# Altium schematic sheet ESP_INPUT_MUX.SchDoc
size A4; SheetNumber: 14; SheetTotal: 16
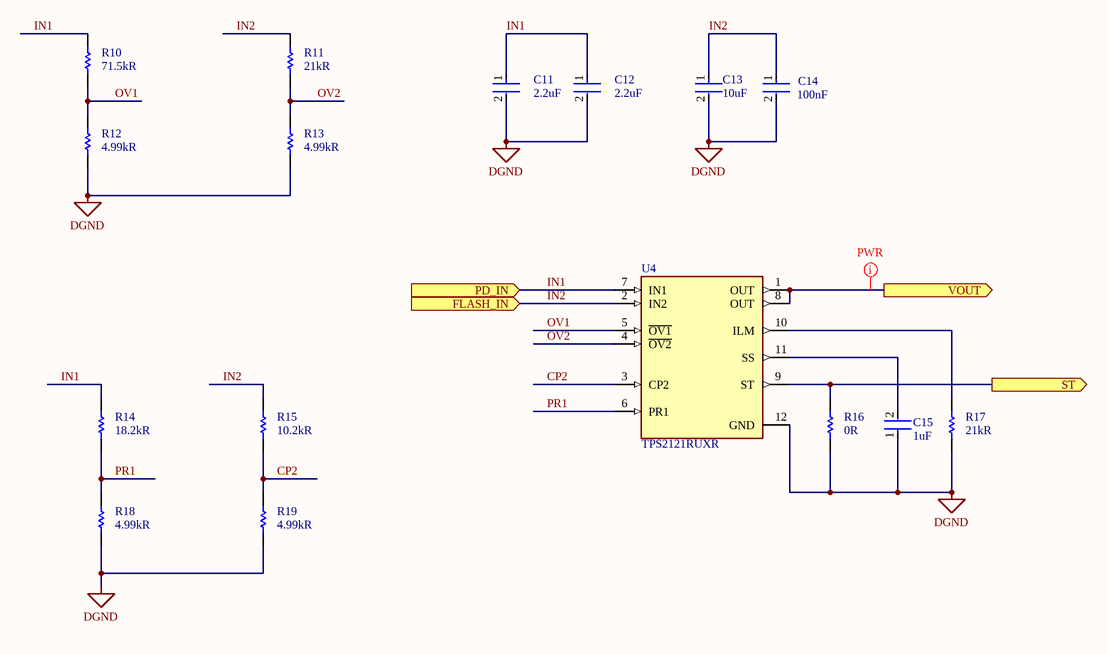
[diagram p0: ESP_INPUT_MUX.SchDoc]

## Parts
C11  Capacitance: 2.2uF  [FP-GRM188-0_2-IPC_C]  (hidden comment: GRM188R61H225KE11D)
C12  Capacitance: 2.2uF  [FP-GRM188-0_2-IPC_C]  (hidden comment: GRM188R61H225KE11D)
C13  value 10uF  [FP-GRM155-0_2-IPC_A]  (hidden comment: GRM155R61A106ME11D)
C14  value 100nF  [FP-CC0402-IPC_B]  (hidden comment: CC0402KRX7R9BB104)
C15  value 1uF  [FP-0402-L_1_0_0_05-W_0_5-MFG]  (hidden comment: EMK105BJ105KV-F)
R10  value 71.5kR  [RESC1005X40X25LL10T10]  (hidden comment: RK73H1ETTP7152F)
R11  value 21kR  [RESC1005X40X25LL10T10]  (hidden comment: RK73H1ETTP2102F)
R12  value 4.99kR  [RESC1005X40X25LL10T10]  (hidden comment: RK73H1ETTP4991F)
R13  value 4.99kR  [RESC1005X40X25LL10T10]  (hidden comment: RK73H1ETTP4991F)
R14  value 18.2kR  [RESC1005X40X25LL10T10]  (hidden comment: RK73H1ETTP1822F)
R15  value 10.2kR  [RESC1005X40X25LL10T10]  (hidden comment: RK73H1ETTP1022F)
R16  value 0R  [FP-RK73Z1E-IPC_B]  (hidden comment: RK73Z1ETTP)  (no BOM)
R17  value 21kR  [RESC1005X40X25ML10T10]  (hidden comment: RK73H1ETTP2102F)
R18  value 4.99kR  [RESC1005X40X25LL10T10]  (hidden comment: RK73H1ETTP4991F)
R19  value 4.99kR  [RESC1005X40X25LL10T10]  (hidden comment: RK73H1ETTP4991F)
U4  TPS2121RUXR  [FP-RUX0012A-MFG]

## Ports
FLASH_IN (in), PD_IN (in), ST (out), VOUT (out)

## Nets
DGND: C11.2 C12.2 C13.2 C14.2 C15.1 R12.1 R13.1 R16.1 R17.1 R18.1 R19.1 U4.12(GND)
CP2: R15.1 R19.2 U4.3(CP2)
IN1: C11.1 C12.1 R10.2 R14.2 U4.7(IN1) ; port PD_IN
IN2: C13.1 C14.1 R11.2 R15.2 U4.2(IN2) ; port FLASH_IN
OV1: R10.1 R12.2 U4.5(~{OV1})
OV2: R11.1 R13.2 U4.4(~{OV2})
PR1: R14.1 R18.2 U4.6(PR1)
ST: R16.2 U4.9(ST) ; port ST
VOUT: U4.1(OUT) U4.8(OUT) ; port VOUT
NetC15_2: C15.2 U4.11(SS)
NetR17_2: R17.2 U4.10(ILM)

## Layout directives
net class PWR: VOUT

## Library data of the parts
C11 C12 = CMP-06035-042125-1: Chip Multilayer Ceramic Capacitors for General Purpose, 0603, 2.2uF, X5R, 15%, 10%, 50V; Case Code (Metric): 1608; Packaging: Cut Tape; REACH SVHC: No SVHC; Material: Ceramic; Voltage Rating: 50V; Min Operating Temperature: -55°C; Length: 0.063inch; Case Code (Imperial): 0603; Tolerance: 10%; Thickness: 0.039inch; Height: 0.8mm; Case/Package: 0603; Voltage Rating (DC): 50V; Dielectric: X5R; Mount: Surface Mount; Max Operating Temperature: 85°C; Width: 0.031inch
C13 = CMP-x00183-1: Ceramic Capacitor, Multilayer, Ceramic, 10V, 20% +Tol, 20% -Tol, X5R, 15% TC, 10uF, Surface Mount, 0402
C14 = CMP-x00152-1: Ceramic Capacitor, Multilayer, Ceramic, 50V, 10% +Tol, 10% -Tol, X7R, 15% TC, 0.1uF, Surface Mount, 0402
C15 = CMP-x00039-4: Ceramic Capacitor, Multilayer, Ceramic, 16V, 10% +Tol, 10% -Tol, X5R, 15% TC, 1uF, Surface Mount, 0402; Manufacturer: Taiyo Yuden; Vendor: TTI; Template: TY_0402; Reel Width: 8mm; Mounting: SMT; Category: Capacitors; MOQ: 10000; Price: 0.000718; Rating: 16V; Package: 0402
R10 = CMP-x00064-2: Fixed Resistor, Metal Glaze/thick Film, 0.1W, 71500ohm, 75V, 1% +/-Tol, 100ppm/Cel, Surface Mount, 0402; Manufacturer: KOA Speer; Reel Width: 8mm; Vendor: TTI; Template: KS_0402; MOQ: 10000; Package: 0402; Price: 0.00297; Category: Resistor; Mounting: SMT
R11 R17 = CMP-2002-03978-1: Manufacturer: KOA Speer; Part Number: RK73H1ETTP2102F
R12 R13 R18 R19 = CMP-x00172-1: Fixed Resistor, Metal Glaze/thick Film, 0.1W, 4990ohm, 75V, 1% +/-Tol, 100ppm/Cel, Surface Mount, 0402
R14 = CMP-x00179-1: Fixed Resistor, Metal Glaze/thick Film, 0.1W, 18200ohm, 75V, 1% +/-Tol, 100ppm/Cel, Surface Mount, 0402
R15 = CMP-x00180-1: Fixed Resistor, Metal Glaze/thick Film, 0.1W, 10200ohm, 75V, 1% +/-Tol, 100ppm/Cel, Surface Mount, 0402
R16 = CMP-x00147-1: Metal Glaze/thick Film, 0ohm, Surface Mount, 0402
U4 = CMP-04910-000009-1: PWR MGMT BATTERY MGMT; Manufacturer: Texas Instruments; Min Supply Voltage: 2.8V; Max Junction Temp: +125°C; Output Voltage: 22V; Output Current: 1.5-5.2A; Standoff Height: 0mm; Number Of Outputs: 1; Nominal Supply Current: 300uA; Device Class L2: Power Management ICs; Octopart: https://octopart.com/tps2121ruxr-texas+instruments-95511053; Mouser Description: 2.7-22V, 56m?, 4.5A, Priority Power MUX with Seamless Switchover 12-VQFN-HR -40 to 125; Lead Free: Yes; Digikey Description: PWR MGMT BATTERY MGMT; Manufacturer Part Number: TPS2121RUXR; Height: 1mm; Device Class L1: Integrated Circuits (ICs); Category: IC; Max Supply Voltage: 22V; ComponentLink2Description: Datasheet; Temperature: -40°C to +125°C; Temperature Range High: +125°C; ComponentLink2URL: https://www.ti.com/lit/ds/symlink/tps2121.pdf; Automotive: No; Package: RUX0012A; RoHS: TRUE; Device Class L3: unset; Temperature Range Low: -40°C